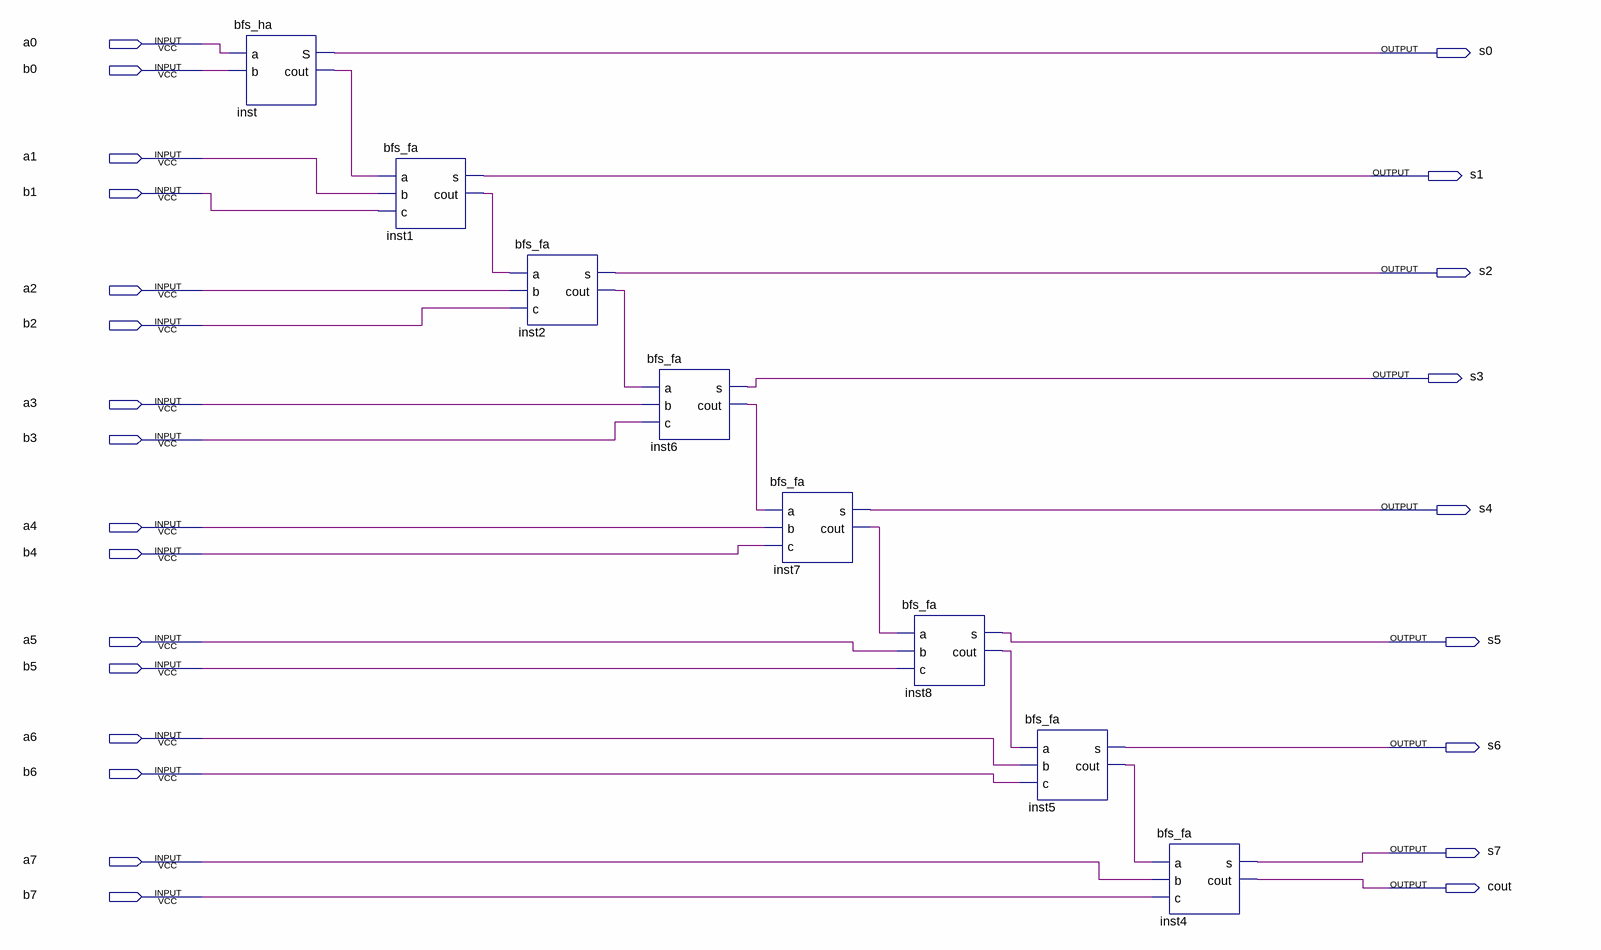
[diagram p0: schematic sheet]
// Quartus schematic bfs_rca.bdf as structural Verilog: 8 symbols, 25 pins
module bfs_rca (
  input  a0,
  input  b0,
  input  a1,
  input  b1,
  input  a2,
  input  b2,
  input  a3,
  input  b3,
  input  a4,
  input  b4,
  input  a5,
  input  b5,
  input  a6,
  input  b6,
  input  a7,
  input  b7,
  output s0,
  output s1,
  output s2,
  output s3,
  output s4,
  output s5,
  output s6,
  output s7,
  output cout
);

  wire inst1_cout, inst2_cout, inst5_cout, inst6_cout, inst7_cout, inst8_cout, inst_cout;

  bfs_ha inst (.a(a0), .b(b0), .S(s0), .cout(inst_cout));
  bfs_fa inst1 (.a(inst_cout), .b(a1), .c(b1), .s(s1), .cout(inst1_cout));
  bfs_fa inst2 (.a(inst1_cout), .b(a2), .c(b2), .s(s2), .cout(inst2_cout));
  bfs_fa inst6 (.a(inst2_cout), .b(a3), .c(b3), .s(s3), .cout(inst6_cout));
  bfs_fa inst7 (.a(inst6_cout), .b(a4), .c(b4), .s(s4), .cout(inst7_cout));
  bfs_fa inst8 (.a(inst7_cout), .b(a5), .c(b5), .s(s5), .cout(inst8_cout));
  bfs_fa inst5 (.a(inst8_cout), .b(a6), .c(b6), .s(s6), .cout(inst5_cout));
  bfs_fa inst4 (.a(inst5_cout), .b(a7), .c(b7), .s(s7), .cout(cout));
endmodule
